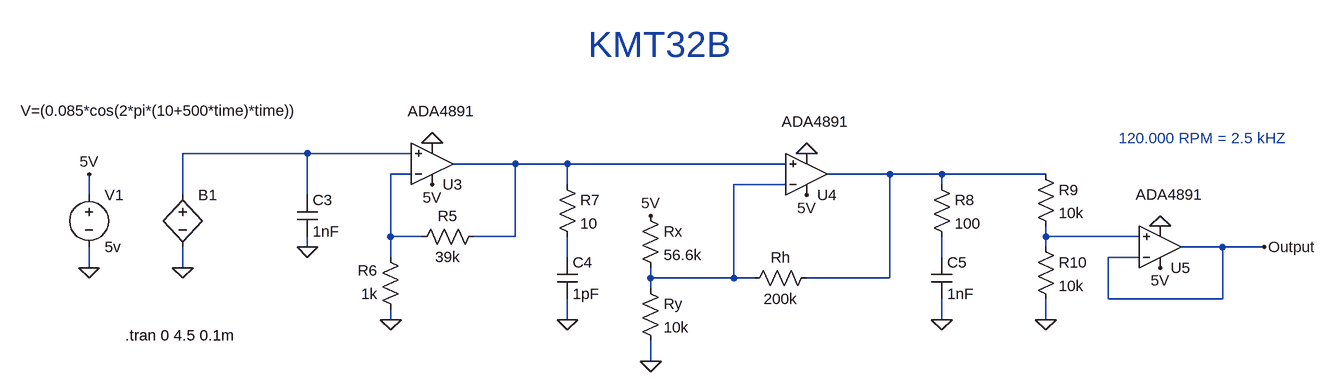
[diagram p0: schematic bv_hall_rpm_2.asc]
bv_hall_rpm_2.asc, the LTspice schematic file:
Version 4.1
SHEET 1 1752 776
WIRE 176 432 -16 432
WIRE 336 432 176 432
WIRE 496 448 400 448
WIRE 576 448 496 448
WIRE 912 448 576 448
WIRE 336 464 304 464
WIRE 1072 464 976 464
WIRE 1152 464 1072 464
WIRE 1312 464 1152 464
WIRE 576 480 576 448
WIRE 912 480 832 480
WIRE 1152 480 1152 464
WIRE -160 496 -160 464
WIRE -16 496 -16 432
WIRE 176 496 176 432
WIRE 304 560 304 464
WIRE 352 560 304 560
WIRE 496 560 496 448
WIRE 496 560 432 560
WIRE 1312 560 1312 544
WIRE 1456 560 1312 560
WIRE 176 576 176 560
WIRE 1312 576 1312 560
WIRE 1584 576 1520 576
WIRE 1648 576 1584 576
WIRE 304 592 304 560
WIRE 576 592 576 560
WIRE 1152 592 1152 560
WIRE 1456 592 1408 592
WIRE -160 608 -160 576
WIRE -16 608 -16 576
WIRE 704 624 704 608
WIRE 832 624 832 480
WIRE 832 624 704 624
WIRE 864 624 832 624
WIRE 1072 624 1072 464
WIRE 1072 624 944 624
WIRE 704 640 704 624
WIRE 1408 656 1408 592
WIRE 1584 656 1584 576
WIRE 1584 656 1408 656
WIRE 304 688 304 672
WIRE 576 688 576 656
WIRE 1152 688 1152 656
WIRE 1312 688 1312 656
WIRE 704 752 704 720
FLAG -160 608 0
FLAG -160 464 5V
FLAG 176 576 0
FLAG 304 688 0
FLAG 368 480 5V
FLAG 368 416 0
FLAG 576 688 0
FLAG 704 528 5V
FLAG 704 752 0
FLAG 944 496 5V
FLAG 944 432 0
FLAG 1152 688 0
FLAG 1312 688 0
FLAG 1488 608 5V
FLAG 1488 544 0
FLAG 1648 576 Output
FLAG -16 608 0
SYMBOL voltage -160 480 R0
WINDOW 123 0 0 Left 0
WINDOW 39 0 0 Left 0
SYMATTR InstName V1
SYMATTR Value 5v
SYMBOL bv -16 480 R0
WINDOW 3 -249 -114 Left 2
SYMATTR Value V=(0.085*cos(2*pi*(10+500*time)*time))
SYMATTR InstName B1
SYMBOL OpAmps\\ADA4891 368 512 M180
WINDOW 3 -38 145 Left 2
SYMATTR InstName U3
SYMBOL res 448 544 R90
WINDOW 0 0 56 VBottom 2
WINDOW 3 32 56 VTop 2
SYMATTR InstName R5
SYMATTR Value 39k
SYMBOL res 320 688 R180
WINDOW 0 36 76 Left 2
WINDOW 3 36 40 Left 2
SYMATTR InstName R6
SYMATTR Value 1k
SYMBOL cap 160 496 R0
SYMATTR InstName C3
SYMATTR Value 1nF
SYMBOL cap 560 592 R0
SYMATTR InstName C4
SYMATTR Value 1pF
SYMBOL res 560 464 R0
SYMATTR InstName R7
SYMATTR Value 10
SYMBOL OpAmps\\ADA4891 944 528 M180
WINDOW 3 -38 145 Left 2
SYMATTR InstName U4
SYMBOL res 688 512 R0
SYMATTR InstName Rx
SYMATTR Value 56.6k
SYMBOL res 688 624 R0
SYMATTR InstName Ry
SYMATTR Value 10k
SYMBOL res 960 608 R90
WINDOW 0 0 56 VBottom 2
WINDOW 3 32 56 VTop 2
SYMATTR InstName Rh
SYMATTR Value 200k
SYMBOL res 1136 464 R0
SYMATTR InstName R8
SYMATTR Value 100
SYMBOL cap 1136 592 R0
SYMATTR InstName C5
SYMATTR Value 1nF
SYMBOL res 1296 448 R0
SYMATTR InstName R9
SYMATTR Value 10k
SYMBOL res 1296 560 R0
SYMATTR InstName R10
SYMATTR Value 10k
SYMBOL OpAmps\\ADA4891 1488 640 M180
WINDOW 3 -38 145 Left 2
SYMATTR InstName U5
TEXT -104 712 Left 2 !.tran 0 4.5 0.1m
TEXT 608 264 Left 5 ;KMT32B
TEXT 1424 408 Left 2 ;120.000 RPM = 2.5 kHZ

The netlist it stands for:
* bv_hall_rpm_2.asc
V1 5V 0 5v
B1 N001 0 V=(0.085*cos(2*pi*(10+500*time)*time))
X§U3 N001 N003 5V 0 N002 ADA4891-1  ; pins In+ In- V+ V- OUT
R5 N002 N003 39k
R6 0 N003 1k
C3 N001 0 1nF
C4 N007 0 1pF
R7 N002 N007 10
X§U4 N002 N005 5V 0 N004 ADA4891-1  ; pins In+ In- V+ V- OUT
Rx 5V N005 56.6k
Ry N005 0 10k
Rh N004 N005 200k
R8 N004 N008 100
C5 N008 0 1nF
R9 N004 N006 10k
R10 N006 0 10k
X§U5 N006 Output 5V 0 Output ADA4891-1  ; pins In+ In- V+ V- OUT
.tran 0 4.5 0.1m
* KMT32B
* 120.000 RPM = 2.5 kHZ
.lib ADA4891-1.lib
.backanno
.end